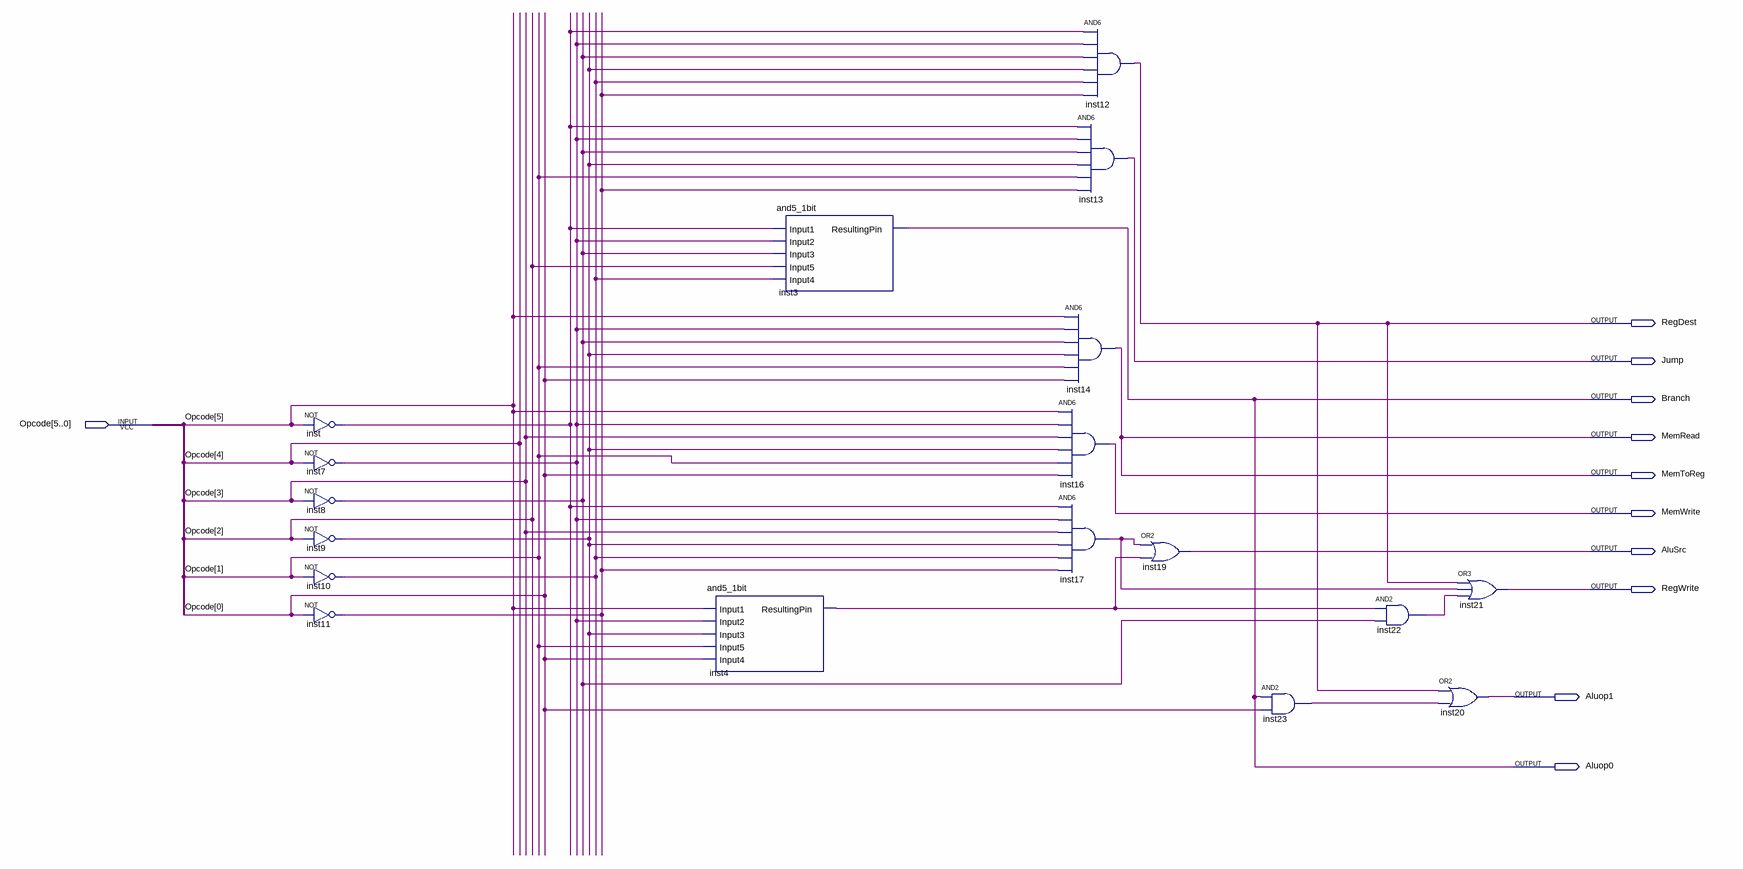
[diagram p0: schematic sheet]
// Quartus schematic control.bdf as structural Verilog: 18 symbols, 11 pins
module control (
  input  [5:0] Opcode,
  output RegDest,
  output Jump,
  output Branch,
  output MemRead,
  output MemToReg,
  output MemWrite,
  output AluSrc,
  output RegWrite,
  output Aluop1,
  output Aluop0
);

  wire inst4_resultingpin, inst7_out, inst8_out, inst9_out, inst10_out, inst11_out, inst17_out, inst22_out,
       inst23_out, inst_out;

  not inst (inst_out, Opcode[5]);
  not inst7 (inst7_out, Opcode[4]);
  not inst8 (inst8_out, Opcode[3]);
  not inst9 (inst9_out, Opcode[2]);
  not inst10 (inst10_out, Opcode[1]);
  not inst11 (inst11_out, Opcode[0]);
  and5_1bit inst4 (
    .Input1(Opcode[5]), .Input2(inst7_out), .Input3(inst9_out), .Input5(Opcode[1]), .Input4(Opcode[0]),
    .ResultingPin(inst4_resultingpin));
  and5_1bit inst3 (
    .Input1(inst_out), .Input2(inst7_out), .Input3(inst8_out), .Input5(Opcode[2]), .Input4(inst10_out),
    .ResultingPin(Aluop0));
  and inst12 (RegDest, inst_out, inst7_out, inst8_out, inst9_out, inst10_out, inst11_out);
  and inst13 (Jump, inst_out, inst7_out, inst8_out, inst9_out, Opcode[1], inst11_out);
  and inst14 (MemRead, Opcode[5], inst7_out, inst8_out, inst9_out, Opcode[1], Opcode[0]);
  and inst16 (MemWrite, Opcode[5], inst7_out, Opcode[3], inst9_out, Opcode[1], Opcode[0]);
  and inst17 (inst17_out, inst_out, inst7_out, Opcode[3], inst9_out, inst10_out, inst11_out);
  or inst19 (AluSrc, inst17_out, inst4_resultingpin);
  and inst23 (inst23_out, Aluop0, Opcode[0]);
  and inst22 (inst22_out, inst4_resultingpin, inst8_out);
  or inst20 (Aluop1, RegDest, inst23_out);
  or inst21 (RegWrite, RegDest, inst17_out, inst22_out);

  assign Branch = Aluop0;
  assign MemToReg = MemRead;
endmodule
